# EAGLE design untitled (EAGLE 7.2.0)
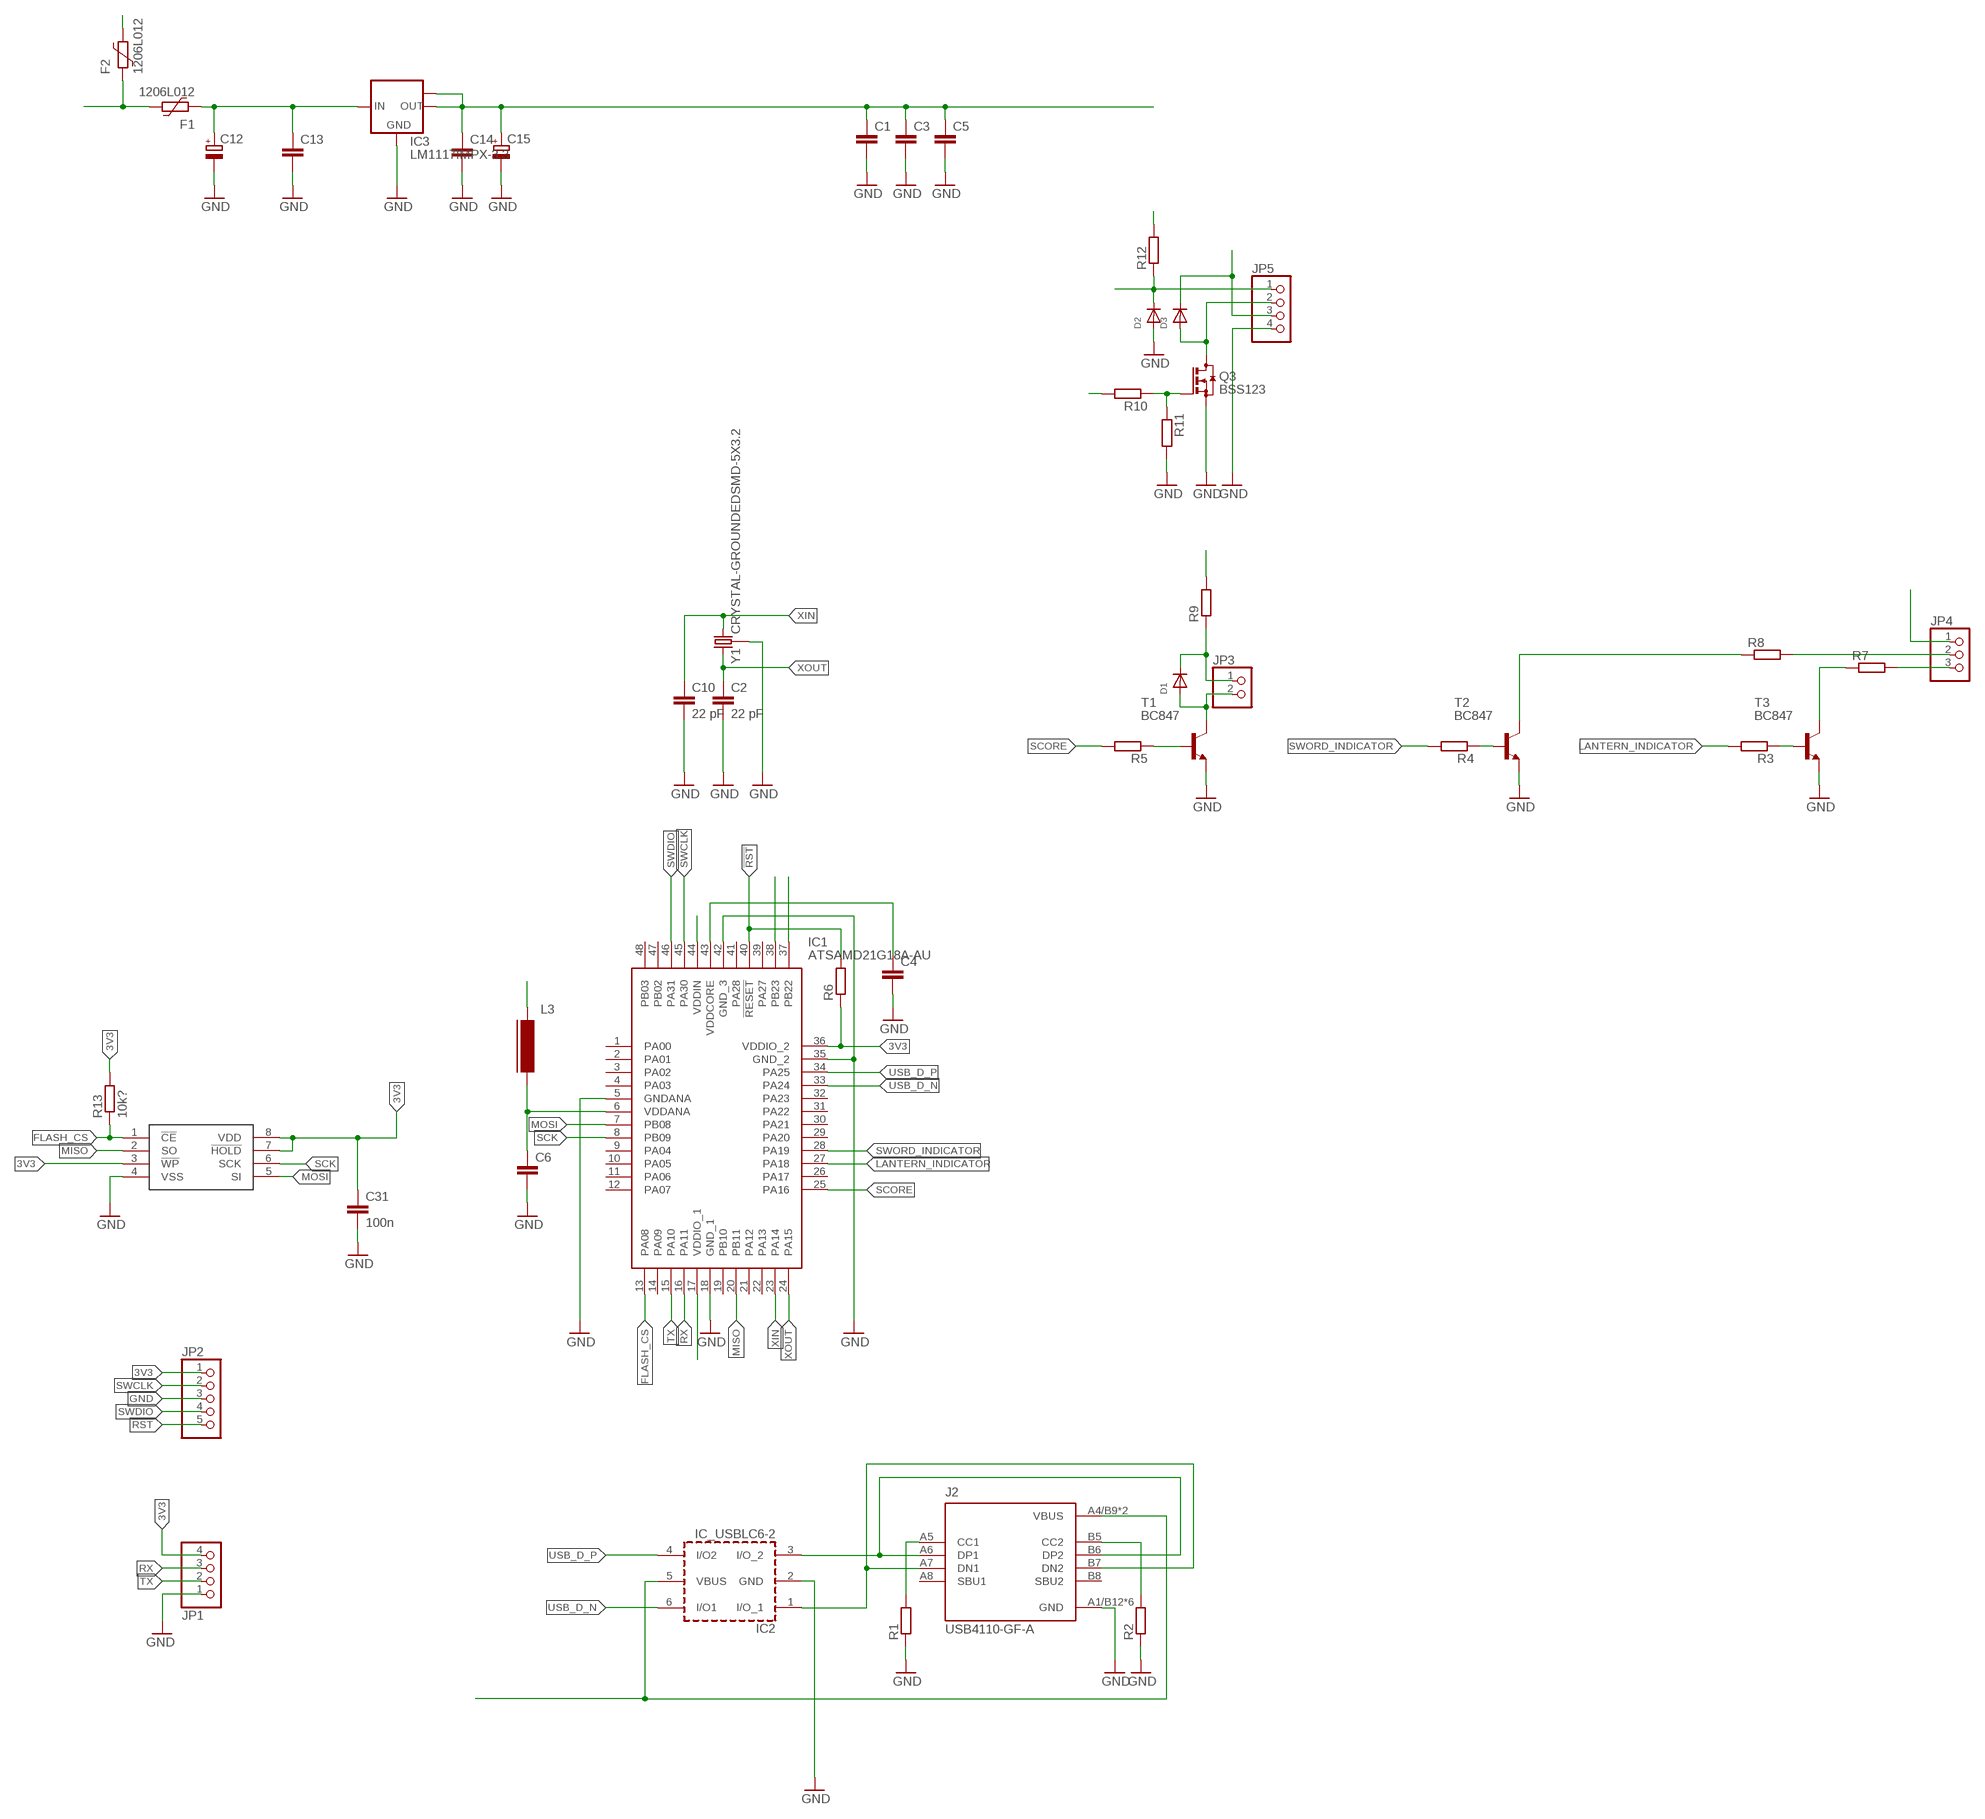
[diagram p0: schematic, sheet 1]

## Parts
C1  C-EUC0402  [C0402]
C2  22 pF  C-EUC0603  [C0603]
C3  C-EUC0402  [C0402]
C4  C-EUC0402  [C0402]
C5  C-EUC0402  [C0402]
C6  C-EUC0402  [C0402]
C10  22 pF  C-EUC0603  [C0603]
C12  CPOL-EUSMCB  [SMC_B]
C13  C-EUC0603  [C0603]
C14  C-EUC0603  [C0603]
C15  CPOL-EUSMCB  [SMC_B]
C31  100n  C-EUC0603  [C0603]
D1  DIODESOD-323  [SOD-323]
D2  DIODESOD-323  [SOD-323]
D3  DIODESOD-323  [SOD-323]
F1  1206L012  [1206L]
F2  1206L012  [1206L]
IC1  ATSAMD21G18A-AU  [QFP50P900X900X120-48N]
IC2  IC_USBLC6-2  [SOT-23-6L]
IC3  LM1117IMPX-3.3  [SOT223]
J2  USB4110-GF-A  [GCT_USB4110-GF-A]
JP1  PINHD-1X4  [1X04]
JP2  PINHD-1X5  [1X05]
JP3  PINHD-1X2  [1X02]
JP4  PINHD-1X3  [1X03]
JP5  PINHD-1X4  [1X04]
L3  FERRITE-0805  [FB805]
Q3  BSS123  [SOT23]
R1  R-EU_R0603  [R0603]
R2  R-EU_R0603  [R0603]
R3  R-EU_R0402  [R0402]
R4  R-EU_R0402  [R0402]
R5  R-EU_R0402  [R0402]
R6  R-EU_R0603  [R0603]
R7  R-EU_R0402  [R0402]
R8  R-EU_R0402  [R0402]
R9  R-EU_R0603  [R0603]
R10  R-EU_R0402  [R0402]
R11  R-EU_R0603  [R0603]
R12  R-EU_R0603  [R0603]
R13  10k?  R-EU_R0603  [R0603]
T1  BC847  [SOT23]
T2  BC847  [SOT23]
T3  BC847  [SOT23]
U$2  SST25VF016BSO8M  [SO-08M]
Y1  CRYSTAL-GROUNDEDSMD-5X3.2  [CRYSTAL-SMD-5X3.2-4PAD]

## Nets
3V3: C1.1 C3.1 C5.1 C14.1 C15.+ C31.1 IC1.17(VDDIO_1) IC1.36(VDDIO_2) IC1.44(VDDIN) IC3.2(OUT) IC3.TAB(OUT1) JP1.4 JP2.1 JP4.1 L3.1 R6.1 R9.2 R12.2 R13.2 U$2.3(!WP) U$2.7(!HOLD) U$2.8(VDD)
5V: C12.+ C13.1 F1.2 IC3.3(IN)
!RST: IC1.40(!RESET) JP2.5 R6.2
D2_N: IC2.1(I/O_1) J2.A7(DN1) J2.B7(DN2)
D2_P: IC2.3(I/O_2) J2.A6(DP1) J2.B6(DP2)
FLASH_CS: IC1.13(PA08) R13.1 U$2.1(!CE)
GND: C1.2 C2.2 C3.2 C4.2 C5.2 C6.2 C10.2 C12.- C13.2 C14.2 C15.- C31.2 D2.A IC1.5(GNDANA) IC1.18(GND_1) IC1.35(GND_2) IC1.42(GND_3) IC2.2(GND) IC3.1(GND) J2.A1/B12(GND) J2.B1/A12(GND) J2.S1(GND) J2.S2(GND) J2.S3(GND) J2.S4(GND) JP1.1 JP2.3 JP5.4 Q3.2(S) R1.1 R2.1 R11.2 T1.2(E) T2.2(E) T3.2(E) U$2.4(VSS) Y1.2 Y1.4
LANTERN_INDICATOR: IC1.27(PA18) R3.2
LOCK: IC1.37(PB22) R10.2
LOCK_5V: D3.C F2.1 JP5.3
LOCK_OPEN: D2.C IC1.38(PB23) JP5.1 R12.1
MISO: IC1.20(PB11) U$2.2(SO)
MOSI: IC1.7(PB08) U$2.5(SI)
N$1: J2.B5(CC2) R2.2
N$2: J2.A5(CC1) R1.2
N$3: R5.1 T1.1(B)
N$4: D1.A JP3.2 T1.3(C)
N$5: R4.1 T2.1(B)
N$6: R3.1 T3.1(B)
N$7: JP4.3 R7.2
N$8: R7.1 T3.3(C)
N$9: JP4.2 R8.2
N$10: R8.1 T2.3(C)
N$12: C6.1 IC1.6(VDDANA) L3.2
N$16: Q3.1(G) R10.1 R11.1
N$17: D3.A JP5.2 Q3.3(D)
RX: IC1.16(PA11) JP1.3
SC3V3: D1.C JP3.1 R9.1
SCK: IC1.8(PB09) U$2.6(SCK)
SCORE: IC1.25(PA16) R5.2
SWCLK: IC1.45(PA30) JP2.2
SWDIO: IC1.46(PA31) JP2.4
SWORD_INDICATOR: IC1.28(PA19) R4.2
TX: IC1.15(PA10) JP1.2
USB_D_N: IC1.33(PA24) IC2.6(I/O1)
USB_D_P: IC1.34(PA25) IC2.4(I/O2)
VBUS: F1.1 F2.2 IC2.5(VBUS) J2.A4/B9(VBUS) J2.B4/A9(VBUS)
VDDCORE: C4.1 IC1.43(VDDCORE)
XIN: C10.1 IC1.23(PA14) Y1.1
XOUT: C2.1 IC1.24(PA15) Y1.3
Unconnected: IC1.1(PA00) IC1.2(PA01) IC1.3(PA02) IC1.4(PA03) IC1.9(PA04) IC1.10(PA05) IC1.11(PA06) IC1.12(PA07) IC1.14(PA09) IC1.19(PB10) IC1.21(PA12) IC1.22(PA13) IC1.26(PA17) IC1.29(PA20) IC1.30(PA21) IC1.31(PA22) IC1.32(PA23) IC1.39(PA27) IC1.41(PA28) IC1.47(PB02) IC1.48(PB03) J2.A8(SBU1) J2.B8(SBU2)

## Library data of the parts
C1-C6 C10 C13 C14 C31 = rcl:C-EU: CAPACITOR, European symbol
C12 C15 = rcl:CPOL-EU: POLARIZED CAPACITOR, European symbol
D1-D3 = adafruit:DIODE: Diode SMADIODE - SMA Surface Mount Package 20V 1A Schottky Diode Digikey: 641-1014-6-ND DO-1N4148 - Through Hole Small Current Diode SOD-123 20V 1 A (.5mV Vf) Schottky Diode - Digikey: MBRX120TPMSCT-ND SOD-323 10V 570mA (.38mV Vf, 3ns) Schottky Diode - Digikey: ZLLS410CT-ND SOD-523 30V 30mA Schottky Diode (RB751S-40TE61) - Digikey: RB751S-40TE61CT-ND SOT23-R/W - SOT23 Package (R = Solder Paste/Reflow Ovens, W = Hand-Soldering) BAT54Film 40V 300mA - Digikey: 497-7162-1-ND
F1 F2 = polyfuse-smd_10:?: Polyfuse Resettable PTC Source: http://www.littelfuse.com/products/resettable-ptcs.aspx; MF: Littelfuse; MPN: 1206L012; OC_FARNELL: 1596988; OC_NEWARK: 05M2298
IC1 = ATSAMD21G18A-AU:ATSAMD21G18A-AU: ARM Microcontrollers - MCU 256KB 32KB 48TQFP GRN1.6-3.6V48MHz Source: Datasheet <https://datasheet.lcsc.com/lcsc/1810010234_Microchip-Tech-ATSAMD21G18A-AU_C78624.pdf>; DESCRIPTION: ARM Microcontrollers - MCU 256KB 32KB 48TQFP GRN1.6-3.6V48MHz; HEIGHT: 1.2mm; MANUFACTURER_NAME: Microchip; MANUFACTURER_PART_NUMBER: ATSAMD21G18A-AU
IC2 = dp_devices:IC_USBLC6-2
IC3 = lm1117:LM1117IMPX-*
J2 = connector_tst:USB4110-GF-A: CONN USB 2.0 TYPE-C R/A SMT; DIGIKEY: 073-USB4110-GF-A-1-ND; MANUFACTURER: GCT; MPN: USB4110-GF-A
JP1 JP5 = pinhead:PINHD-1X4: PIN HEADER
JP2 = pinhead:PINHD-1X5: PIN HEADER
JP3 = pinhead:PINHD-1X2: PIN HEADER
JP4 = pinhead:PINHD-1X3: PIN HEADER
L3 = dp_devices:FERRITE: Ferrite bead in various packages
Q3 = transistor-small-signal:BSS123: N-CHANNEL MOS FET
R1-R13 = rcl:R-EU_: RESISTOR, European symbol
T1-T3 = transistor:BC847: NPN TRANSISTOR
U$2 = mw:SST25VF016B
Y1 = SparkFun-Clocks:CRYSTAL-GROUNDED: Crystals w/ Ground Pin (Generic) These are passive quartz crystals, which can be used as a clock source for a microcontroller. Crystal's are usually two-terminal devices. A third terminal may be optionally connected to ground, as recommended by the manufaturer.

## Board
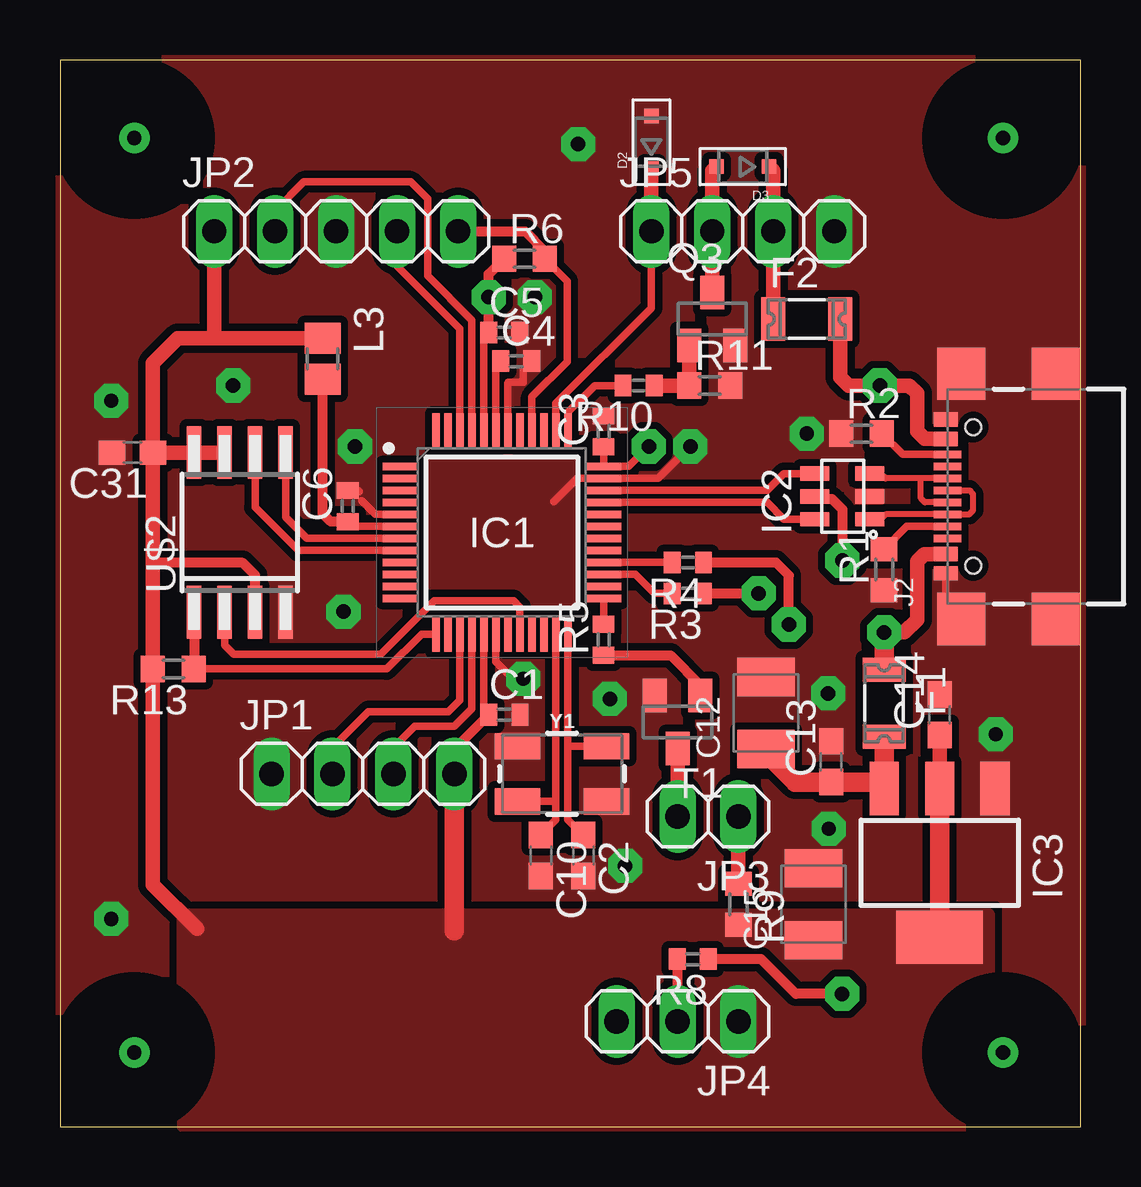
[diagram p1: board, top side]
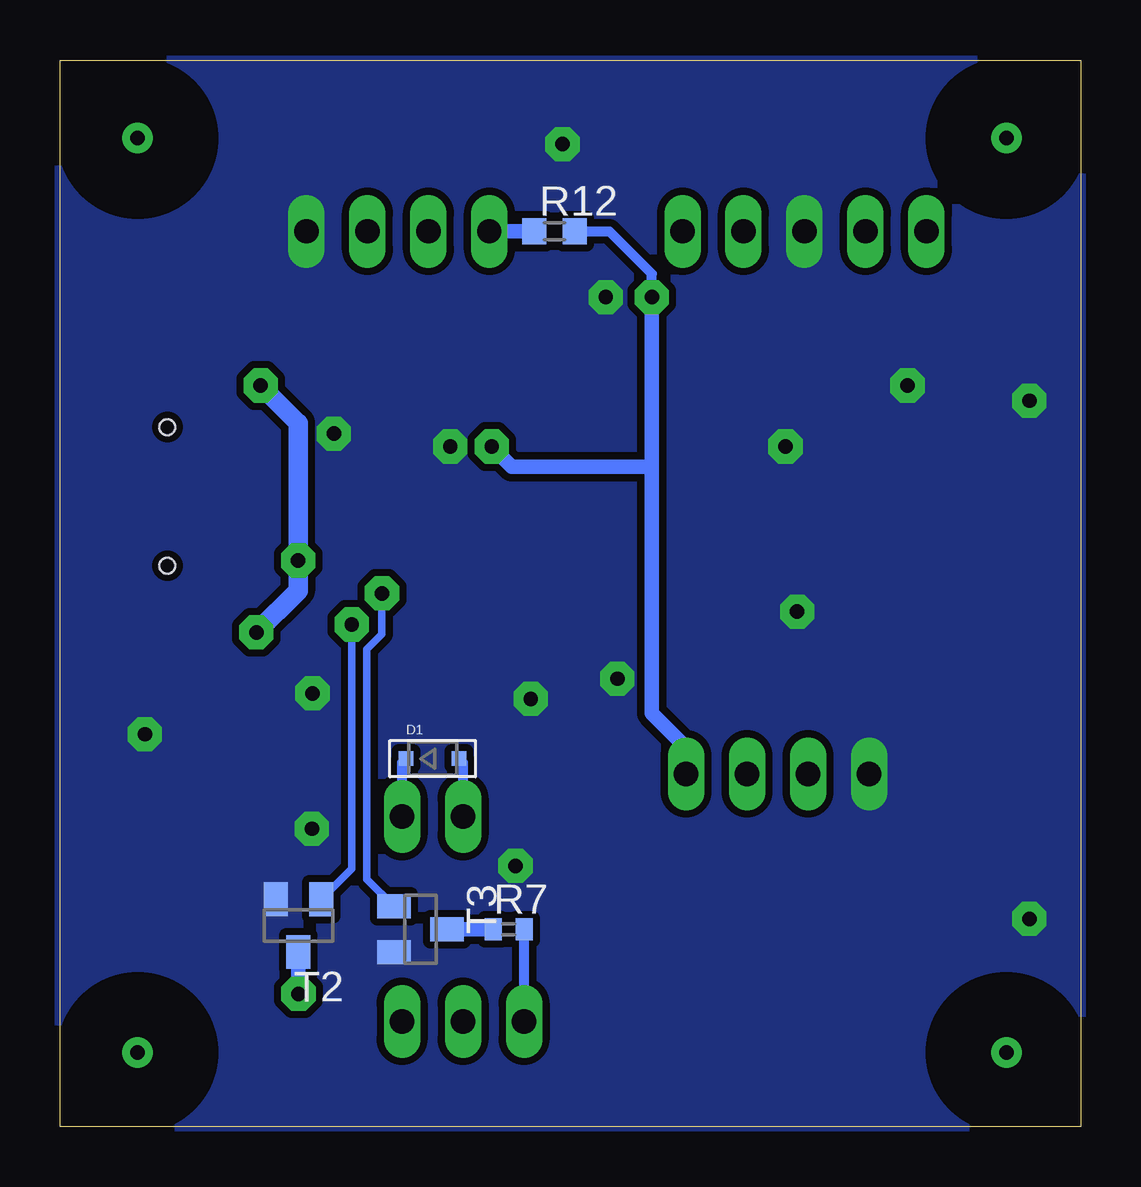
[diagram p2: board, bottom side, seen from below]

Size 42.52 x 44.45 mm. Coordinates in mm from the lower left corner, seen from the top.
Outline: 0,0 42.52,0 42.52,44.45 0,44.45 0,0
Copper layers (1*16): Top 0.035mm / dielectric 1.5mm / Bottom 0.035mm
Design rules "default *": minimum track width 10mil, minimum drill 24mil, track to track 8mil, track to pad 8mil, pad to pad 8mil, via to via 8mil, smd to smd 8mil, copper to edge 0mil, drill to drill 8mil, minimum pad ring 10mil, minimum via ring 8mil, stop-mask expansion 4mil, vias tented up to drill 0mil, thermal gap 10mil
tRestrict: area 33.4,16.7 to 35.2,18.6; area 36.2,0 to 42.3,6.1; area 0,0 to 6.1,6.1; area 0,38.1 to 6.1,44.2; area 36.2,38.1 to 42.3,44.2; area 30.2,32.8 to 32.1,34.6
bRestrict: area 36.2,0 to 42.3,6.1; area 0,0 to 6.1,6.1; area 0,38.1 to 6.1,44.2; area 36.2,38.1 to 42.3,44.2

### Footprints (pad centres in the part's own frame; a part is rotated, then mirrored left to right if it is on the bottom)
C0402 = smd 0.7 x 0.9: 1 -0.65,0; 2 0.65,0
C0603 = smd 1.1 x 1: 1 -0.85,0; 2 0.85,0
SMC_B = smd 1.6 x 2.4: + -1.5,0; - 1.5,0
SOD-323 = smd 0.6 x 0.6: A 1.1,0; C -1.1,0
1206L = smd 1 x 1.8: 1 -1.4,0; 2 1.4,0
QFP50P900X900X120-48N = smd 1.475 x 0.3: 1 -4.238,2.75; 2 -4.238,2.25; 3 -4.238,1.75; 4 -4.238,1.25; 5 -4.238,0.75; 6 -4.238,0.25; 7 -4.238,-0.25; 8 -4.238,-0.75; 9 -4.238,-1.25; 10 -4.238,-1.75; 11 -4.238,-2.25; 12 -4.238,-2.75; 25 4.238,-2.75; 26 4.238,-2.25; 27 4.238,-1.75; 28 4.238,-1.25; 29 4.238,-0.75; 30 4.238,-0.25; 31 4.238,0.25; 32 4.238,0.75; 33 4.238,1.25; 34 4.238,1.75; 35 4.238,2.25; 36 4.238,2.75 | smd 0.3 x 1.475: 13 -2.75,-4.238; 14 -2.25,-4.238; 15 -1.75,-4.238; 16 -1.25,-4.238; 17 -0.75,-4.238; 18 -0.25,-4.238; 19 0.25,-4.238; 20 0.75,-4.238; 21 1.25,-4.238; 22 1.75,-4.238; 23 2.25,-4.238; 24 2.75,-4.238; 37 2.75,4.238; 38 2.25,4.238; 39 1.75,4.238; 40 1.25,4.238; 41 0.75,4.238; 42 0.25,4.238; 43 -0.25,4.238; 44 -0.75,4.238; 45 -1.25,4.238; 46 -1.75,4.238; 47 -2.25,4.238; 48 -2.75,4.238
SOT-23-6L = smd 0.6 x 1.2: 1 -0.95,-2.3; 2 0,-2.3; 3 0.95,-2.3; 4 0.95,0; 5 0,0; 6 -0.95,0
SOT223 = smd 1.219 x 2.235: 1 -2.311,-3.099; 2 0,-3.099; 3 2.311,-3.099 | smd 3.6 x 2.2: TAB 0,3.099
GCT_USB4110-GF-A = smd 0.6 x 1: A1/B12 -3.2,1.15; A4/B9 -2.4,1.15; B1/A12 3.2,1.15; B4/A9 2.4,1.15 | smd 0.3 x 1.15: A5 -1.25,1.075; A6 -0.25,1.075; A7 0.25,1.075; A8 1.25,1.075; B5 1.75,1.075; B6 0.75,1.075; B7 -0.75,1.075; B8 -1.75,1.075 | smd 2.18 x 2: S1 -5.11,0.5; S2 5.11,0.5; S3 -5.11,-3.43; S4 5.11,-3.43 | hole 0.65: -2.89,0; 2.89,0
1X04 = drill 1.016 long: 1 -3.81,0; 2 -1.27,0; 3 1.27,0; 4 3.81,0
1X05 = drill 1.016 long: 1 -5.08,0; 2 -2.54,0; 3 0,0; 4 2.54,0; 5 5.08,0
1X02 = drill 1.016 long: 1 -1.27,0; 2 1.27,0
1X03 = drill 1.016 long: 1 -2.54,0; 2 0,0; 3 2.54,0
FB805 = smd 1.3 x 1.5: 1 -0.85,0; 2 0.85,0
SOT23 = smd 1 x 1.4: 1 -0.95,-1.1; 2 0.95,-1.1; 3 0,1.1
R0603 = smd 1 x 1.1: 1 -0.85,0; 2 0.85,0
R0402 = smd 0.7 x 0.9: 1 -0.65,0; 2 0.65,0
SO-08M = smd 0.6 x 2.2: 1 -1.905,-3.33; 2 -0.635,-3.33; 3 0.635,-3.33; 4 1.905,-3.33; 5 1.905,3.33; 6 0.635,3.33; 7 -0.635,3.33; 8 -1.905,3.33
CRYSTAL-SMD-5X3.2-4PAD = smd 1.9 x 1.1: 1 -1.85,-1.15; 2 1.85,-1.15; 3 1.85,1.15; 4 -1.85,1.15

### Placement (x,y rotation side)
C1  18.51,17.17 0 top
C2  21.8,11.3 270 top
C3  22.65,28.98 90 top
C4  19.01,31.9 0 top
C5  18.51,33.1 0 top
C6  11.99,25.86 90 top
C10  20.03,11.3 270 top
C12  29.41,17.25 90 top
C13  32.13,15.21 90 top
C14  36.65,17.17 90 top
C15  31.39,9.27 90 top
C31  3.02,28.09 180 top
D1  27,15.34 0 bottom
D2  24.64,41.02 90 top
D3  28.45,40.01 180 top
F1  34.34,17.65 270 top
F2  31.11,33.66 0 top
IC1  18.41,24.77 0 top
IC2  31.45,26.26 90 top
IC3  36.65,11 180 top
J2  38.05,26.26 90 top
JP1  12.62,14.71 0 top
JP2  11.51,37.31 0 top
JP3  27,12.93 180 top
JP4  25.73,4.39 180 top
JP5  28.45,37.31 0 top
L3  10.95,32 270 top
Q3  27.18,33.66 0 top
R1  34.34,23.22 90 top
R2  33.4,28.88 0 top
R3  26.16,22.23 180 top
R4  26.16,23.52 180 top
R5  22.65,20.29 90 top
R6  19.35,36.17 0 top
R7  23.83,8.23 0 bottom
R8  26.37,6.99 180 top
R9  28.27,9.27 270 top
R10  24.1,30.89 180 top
R11  27.08,30.89 0 top
R12  21.92,37.31 0 bottom
R13  4.72,19.08 180 top
T1  25.73,16.87 180 top
T2  32.59,8.38 180 bottom
T3  27.51,8.23 270 bottom
U$2  7.49,24.77 0 top
Y1  20.92,14.71 0 top

### Tracks (layer width: path | path; a pad name or v marks a point on that pad's centre or on a via)
3V3  (via drill 0.6 pad 1.42)
  Top 0.305: IC1.17 17.66,17.37 C1.1 | IC1.44 17.66,32.9 C5.1 | C3.1 IC1.36 23.7,27.52 v24.54,28.35
  Top 0.406: JP1.4 16.43,15.74 C1.1 | R6.1 17.86,35.53 v17.86,34.57 C5.1 | U$2.3 8.13,22.99 7.62,23.5 3.87,23.5
  Top 0.61: IC3.2 C14.1 | U$2.7 U$2.8 C31.1 | 5.71,8.26 3.87,10.1 R13.2 3.87,23.5 C31.1 | L3.1 6.43,32.85 | C31.1 3.87,31.81 4.91,32.85 6.43,32.85 | JP2.1 6.43,32.85
  Top 0.813: JP1.4 16.43,8.18 | IC3.TAB IC3.2
  Bottom 0.406: v17.86,34.57 17.86,35.54 19.63,37.31 R12.2
  Bottom 0.61: JP1.4 16.43,15.8 17.86,17.23 17.86,27.51 | v24.54,28.35 23.7,27.51 17.86,27.51 | v17.86,34.57 17.86,27.51
  pour Top (isolate 0.305, no thermals): 38.73,8.89 38.73,0 5.08,0 5.08,8.89
5V
  Top 0.61: C12.+ 29.41,16
  Top 0.813: F1.2 IC3.3 34.34,14.37 C13.1 30.64,14.37 29.41,15.6 C12.+ | F1.2
!RST
  Top 0.305: IC1.40 19.66,30.41 21.13,31.88 21.13,35.24 R6.2
  Top 0.406: JP2.5 19.38,37.31 20.2,36.49 R6.2
D2_N
  Top 0.254: IC2.1 34.2,25.31 34.4,25.51 J2.B7 37.88,25.51 38.05,25.68 38.05,26.36 37.9,26.51 J2.A7
D2_P
  Top 0.254: J2.B6 35.92,27.01 | 35.92,27.01 34.4,27.01 34.2,27.21 IC2.3 | J2.A6 36.04,26.01 35.87,26.19 35.87,26.96 35.92,27.01
FLASH_CS
  Top 0.305: R13.1 13.61,19.07 15.07,20.53 IC1.13
  Top 0.406: U$2.1 5.59,19.09 R13.1
GND  (via drill 0.6 pad 1.42)
  Top 0.305: 20.57,26.04 21.55,27.02 IC1.35 24.93,27.02 v26.26,28.35 | IC1.18 18.16,19.38 18.87,18.67 v19.3,18.67 | IC1.42 18.66,30.98 18.67,31.01 19.3,31.01 19.3,31.54 C4.2 | J2.A1/B12 36.9,20.39 36.83,20.32 | 12.47,26.47 12.45,26.49 | IC1.5 13.14,25.52 12.57,26.09
  other vias: 11.81,21.46 31.11,28.88 19.79,34.57 38.99,16.36 32,18.06 22.91,17.83 23.55,10.87 32.03,12.42 12.29,28.35 7.21,30.89 2.13,30.25 2.13,8.66 21.59,40.94
  pour Top (isolate 0.305, rank 2, no thermals): 0,44.45 0,0 42.55,0 42.55,44.45
  pour Bottom (isolate 0.305, no thermals): 0,44.45 0,0 42.55,0 42.55,44.45
LANTERN_INDICATOR
  Top 0.305: IC1.27 23.98,23.02 24.77,22.23 R3.2
LOCK
  Top 0.305: IC1.37 21.16,29.78 22.28,30.89 R10.2
LOCK_5V
  Top 0.61: F2.1 JP5.3 29.72,39.84 D3.C
LOCK_OPEN
  Top 0.305: IC1.38 20.66,30.14 24.64,34.11 JP5.1
  Top 0.61: JP5.1 D2.C
  Bottom 0.61: JP5.1 R12.1
MISO
  Top 0.305: IC1.20 19.16,21.65 18.9,21.92 15.6,21.92 13.36,19.68 7.24,19.68 6.86,20.07 U$2.2
MOSI
  Top 0.305: IC1.7 10.28,24.52 9.4,25.4 U$2.5
N$1
  Top 0.305: J2.B5 35.11,28.01 R2.2
N$2
  Top 0.305: J2.A5 35.29,25.01 R1.2
N$3
  Top 0.406: R5.1 25.44,19.64 26.68,18.41 T1.1
N$4
  Top 0.61: JP3.2 T1.3
  Bottom 0.406: JP3.2 25.73,15.17 D1.A
N$5  (via drill 0.6 pad 1.42)
  Top 0.406: R4.1 29.82,23.52 30.37,22.97 v30.37,20.93
  Bottom 0.305: T2.1 30.37,10.75 v30.37,20.93
N$6  (via drill 0.6 pad 1.42)
  Top 0.406: R3.1 v29.11,22.23
  Bottom 0.305: v29.11,22.23 29.11,20.52 29.74,19.89 29.74,10.31 T3.1
N$7
  Bottom 0.406: JP4.3 23.19,8.21 R7.2
N$8
  Bottom 0.61: T3.3 R7.1
N$9
  Top 0.406: JP4.2 25.73,6.97 R8.2
N$10  (via drill 0.6 pad 1.42)
  Top 0.406: v32.59,5.54 30.66,5.54 29.21,6.99 R8.1
  Bottom 0.61: T2.3 v32.59,5.54
N$11  (via drill 0.6 pad 1.27)
  other vias: 3.1,3.1
N$12
  Top 0.305: IC1.6 12.19,25.02 C6.1
  Top 0.406: C6.1 11.29,25.21 10.95,25.55 L3.2
N$13  (via drill 0.6 pad 1.27)
  other vias: 39.29,3.1
N$14  (via drill 0.6 pad 1.27)
  other vias: 3.1,41.2
N$15  (via drill 0.6 pad 1.27)
  other vias: 39.29,41.2
N$16
  Top 0.61: R10.1 R11.1 Q3.1
N$17
  Top 0.61: Q3.3 JP5.2 27.18,39.84 D3.A
RX
  Top 0.305: JP1.3 13.89,15.8 14.78,16.69 16.43,16.69 17.16,17.42 IC1.16
SC3V3
  Top 0.61: R9.1 JP3.1
  Bottom 0.406: JP3.1 28.27,15.17 D1.C
SCK
  Top 0.305: IC1.8 9.92,24.02 8.13,25.81 U$2.6
SCORE
  Top 0.305: IC1.25 R5.2
SWCLK
  Top 0.305: IC1.45 17.16,33.61 15.32,35.46 15.32,38.66 14.61,39.37 10.16,39.37 8.97,38.18 JP2.2
SWDIO
  Top 0.305: IC1.46 16.66,33.25 14.05,35.87 JP2.4
SWORD_INDICATOR
  Top 0.305: IC1.28 R4.2
TX
  Top 0.305: IC1.15 16.66,17.78 16.18,17.3 12.85,17.3 11.35,15.8 JP1.2
USB_D_N
  Top 0.305: IC1.33 29.46,26.02 30.16,25.31 IC2.6
USB_D_P
  Top 0.305: IC1.34 29.46,26.52 30.16,27.21 IC2.4
VBUS  (via drill 0.6 pad 1.42)
  Top 0.406: IC2.5 31.55,26.17 32.16,26.17 32.6,25.72 v32.6,23.6
  Top 0.61: J2.A4/B9 36.01,23.86 35.71,23.57 35.71,21.13 35.18,20.6 v34.34,20.6 | J2.B4/A9 36.03,28.66 35.71,28.98 35.71,30.56 35.38,30.89 v34.16,30.89 32.87,30.89 32.52,31.24 F2.2
  Top 0.813: v34.34,20.6 F1.1
  Bottom 0.813: v34.16,30.89 32.6,29.32 v32.6,23.6 32.6,22.34 v34.34,20.6
VDDCORE
  Top 0.305: IC1.43 18.16,31.71 C4.1
XIN
  Top 0.305: IC1.23 20.66,13.49 | 20.66,13.49 20.66,12.79 C10.1 | Y1.1 20.6,13.56 20.66,13.49
XOUT
  Top 0.305: IC1.24 21.16,15.82 | 21.16,15.82 21.16,12.79 C2.1 | Y1.3 21.2,15.86 21.16,15.82